# EAGLE schematic Welder_PSU (EAGLE 9.6.2)
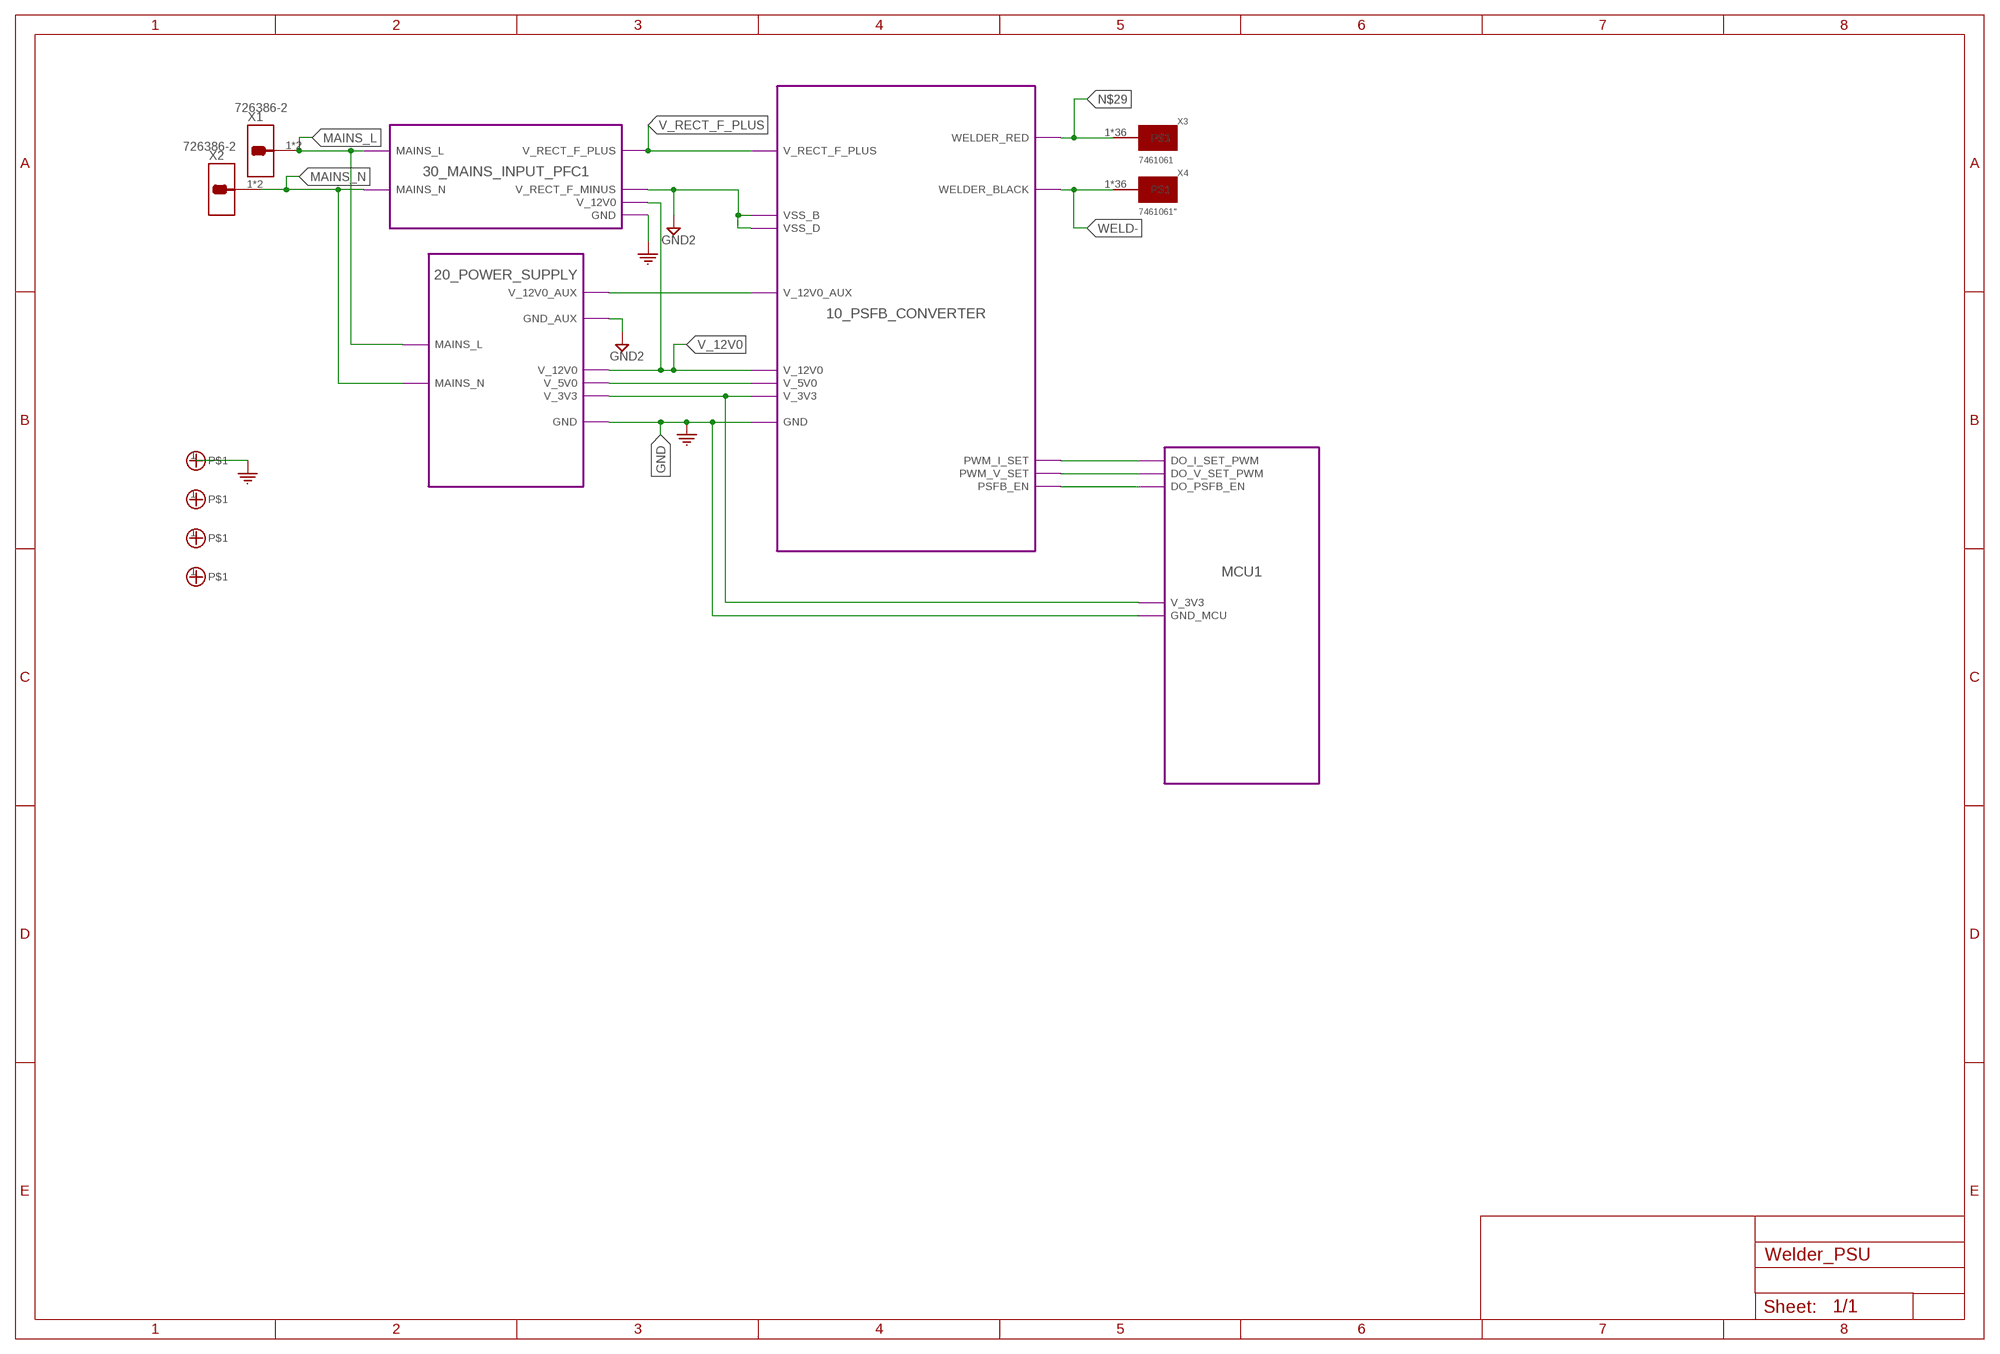
[diagram p0: schematic, sheet 1]

## Parts
M1  M_HOLE_3M  [PCB_SCREW_M3_POWER]
M2  M_HOLE_3M  [PCB_SCREW_M3_POWER]
M3  M_HOLE_3M  [PCB_SCREW_M3_POWER]
M4  M_HOLE_3M  [PCB_SCREW_M3_POWER]
X1  726386-2  [TE_726386-2_MODIFIED]
X2  726386-2  [TE_726386-2_MODIFIED]
X3  7461061  [X01_M10_7461061]
X4  7461061"  [X01_M10_7461061_MODIFIED]

## Module instances
10_PSFB_CONVERTER = 10_PSFB_CONVERTER (part numbers offset by 100)
20_POWER_SUPPLY = 20_POWER_SUPPLY (part numbers offset by 200)
MCU1 = 40_MCU (part numbers offset by 400)
30_MAINS_INPUT_PFC1 = 30_MAINS_INPUT_PFC (part numbers offset by 300)

## Nets
GND [LV]: M1.1 ; port 30_MAINS_INPUT_PFC1.GND 10_PSFB_CONVERTER.GND 20_POWER_SUPPLY.GND MCU1.GND_MCU
GND2 [HV-Minus]: port 30_MAINS_INPUT_PFC1.V_RECT_F_MINUS 10_PSFB_CONVERTER.VSS_B 10_PSFB_CONVERTER.VSS_D 20_POWER_SUPPLY.GND_AUX
MAINS_L [HV-L]: X1.1 X1.1-2 ; port 30_MAINS_INPUT_PFC1.MAINS_L 20_POWER_SUPPLY.MAINS_L
MAINS_N [HV-N]: X2.1 X2.1-2 ; port 30_MAINS_INPUT_PFC1.MAINS_N 20_POWER_SUPPLY.MAINS_N
N$1: port 10_PSFB_CONVERTER.PWM_I_SET MCU1.DO_I_SET_PWM
N$2: port 10_PSFB_CONVERTER.PWM_V_SET MCU1.DO_V_SET_PWM
N$3: port 10_PSFB_CONVERTER.PSFB_EN MCU1.DO_PSFB_EN
N$29 [LV]: X3.1 X3.1-1 X3.1-2 X3.1-3 X3.1-4 X3.1-5 X3.1-6 X3.1-7 X3.1-8 X3.1-9 X3.1-10 X3.1-11 X3.1-12 X3.1-13 X3.1-14 X3.1-15 X3.1-16 X3.1-17 X3.1-18 X3.1-19 X3.1-20 X3.1-21 X3.1-22 X3.1-23 X3.1-24 X3.1-25 X3.1-26 X3.1-27 X3.1-28 X3.1-29 X3.1-30 X3.1-31 X3.1-32 X3.1-33 X3.1-34 X3.1-35 ; port 10_PSFB_CONVERTER.WELDER_RED
V_3V3 [LV]: port 20_POWER_SUPPLY.V_3V3 10_PSFB_CONVERTER.V_3V3 MCU1.V_3V3
V_5V0: port 20_POWER_SUPPLY.V_5V0 10_PSFB_CONVERTER.V_5V0
V_12V0: port 20_POWER_SUPPLY.V_12V0 10_PSFB_CONVERTER.V_12V0 30_MAINS_INPUT_PFC1.V_12V0
V_12V0_AUX [HV-Minus]: port 20_POWER_SUPPLY.V_12V0_AUX 10_PSFB_CONVERTER.V_12V0_AUX
V_RECT_F_PLUS [HV-Plus]: port 30_MAINS_INPUT_PFC1.V_RECT_F_PLUS 10_PSFB_CONVERTER.V_RECT_F_PLUS
WELD-: X4.1 X4.1-1 X4.1-2 X4.1-3 X4.1-4 X4.1-5 X4.1-6 X4.1-7 X4.1-8 X4.1-9 X4.1-10 X4.1-11 X4.1-12 X4.1-13 X4.1-14 X4.1-15 X4.1-16 X4.1-17 X4.1-18 X4.1-19 X4.1-20 X4.1-21 X4.1-22 X4.1-23 X4.1-24 X4.1-25 X4.1-26 X4.1-27 X4.1-28 X4.1-29 X4.1-30 X4.1-31 X4.1-32 X4.1-33 X4.1-34 X4.1-35 ; port 10_PSFB_CONVERTER.WELDER_BLACK
Unconnected: M2.1 M3.1 M4.1

## Library data of the parts
M1-M4 = Labops_Lib_AH:M_HOLE_3M
X1 X2 = Labops_Lib_AH:726386-2: Terminals, Faston, GDS-Flachstecker 6.3x0.8mm, TE; DESCRIPTION: 0.250" (6.35mm) Quick Connect Male - Solder Connector Non-Insulated; MFN: 726386-2; MFR: TE Connectivity; PART_VALUE: 6.35mmx8mm; PRICE-1: 0.24; SUPPLIER-1: Digikey
X3 X4 = 3D_MIG_Controller:7461061: Pin Screw Terminal, Power Tap M10 Through Hole, Pressfit, Redcube series

## Module 10_PSFB_CONVERTER
Ports: V_12V0(in) V_12V0_AUX(in) V_5V0(in) V_3V3(in) WELDER_RED(io) WELDER_BLACK(io) PWM_I_SET(io) V_RECT_F_PLUS(io) VSS_B(io) VSS_D(io) GND(io) PWM_V_SET(io) PSFB_EN(io)
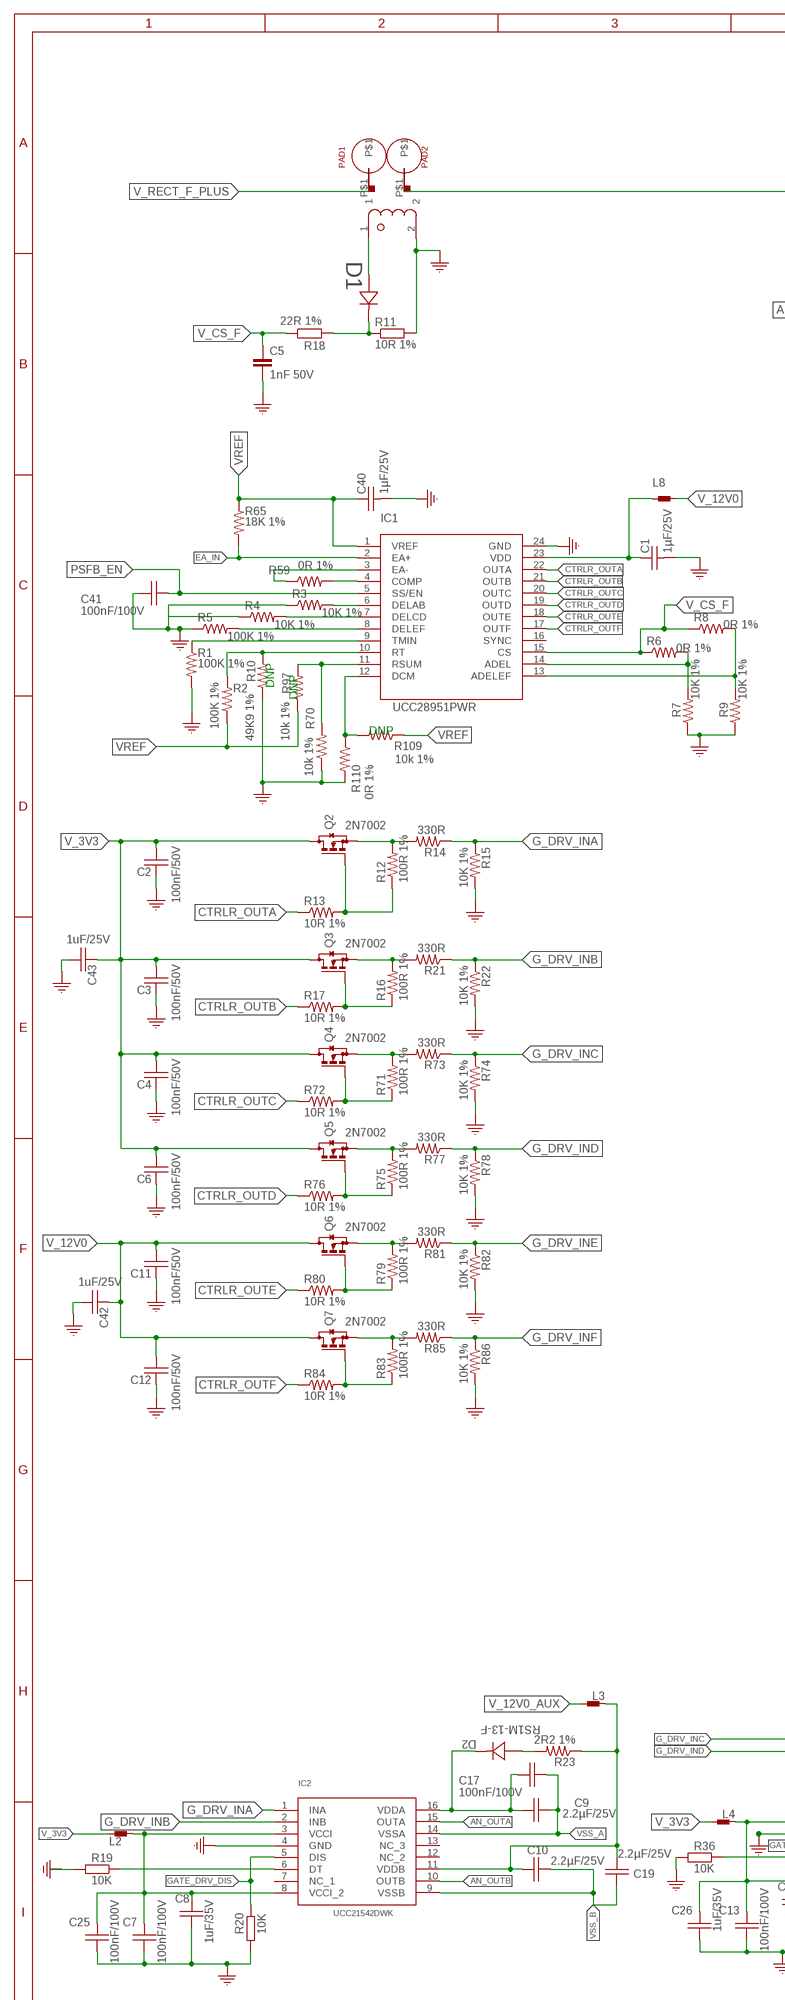
[diagram p1: schematic, module 10_PSFB_CONVERTER, sheet 1, part 1 of 2]
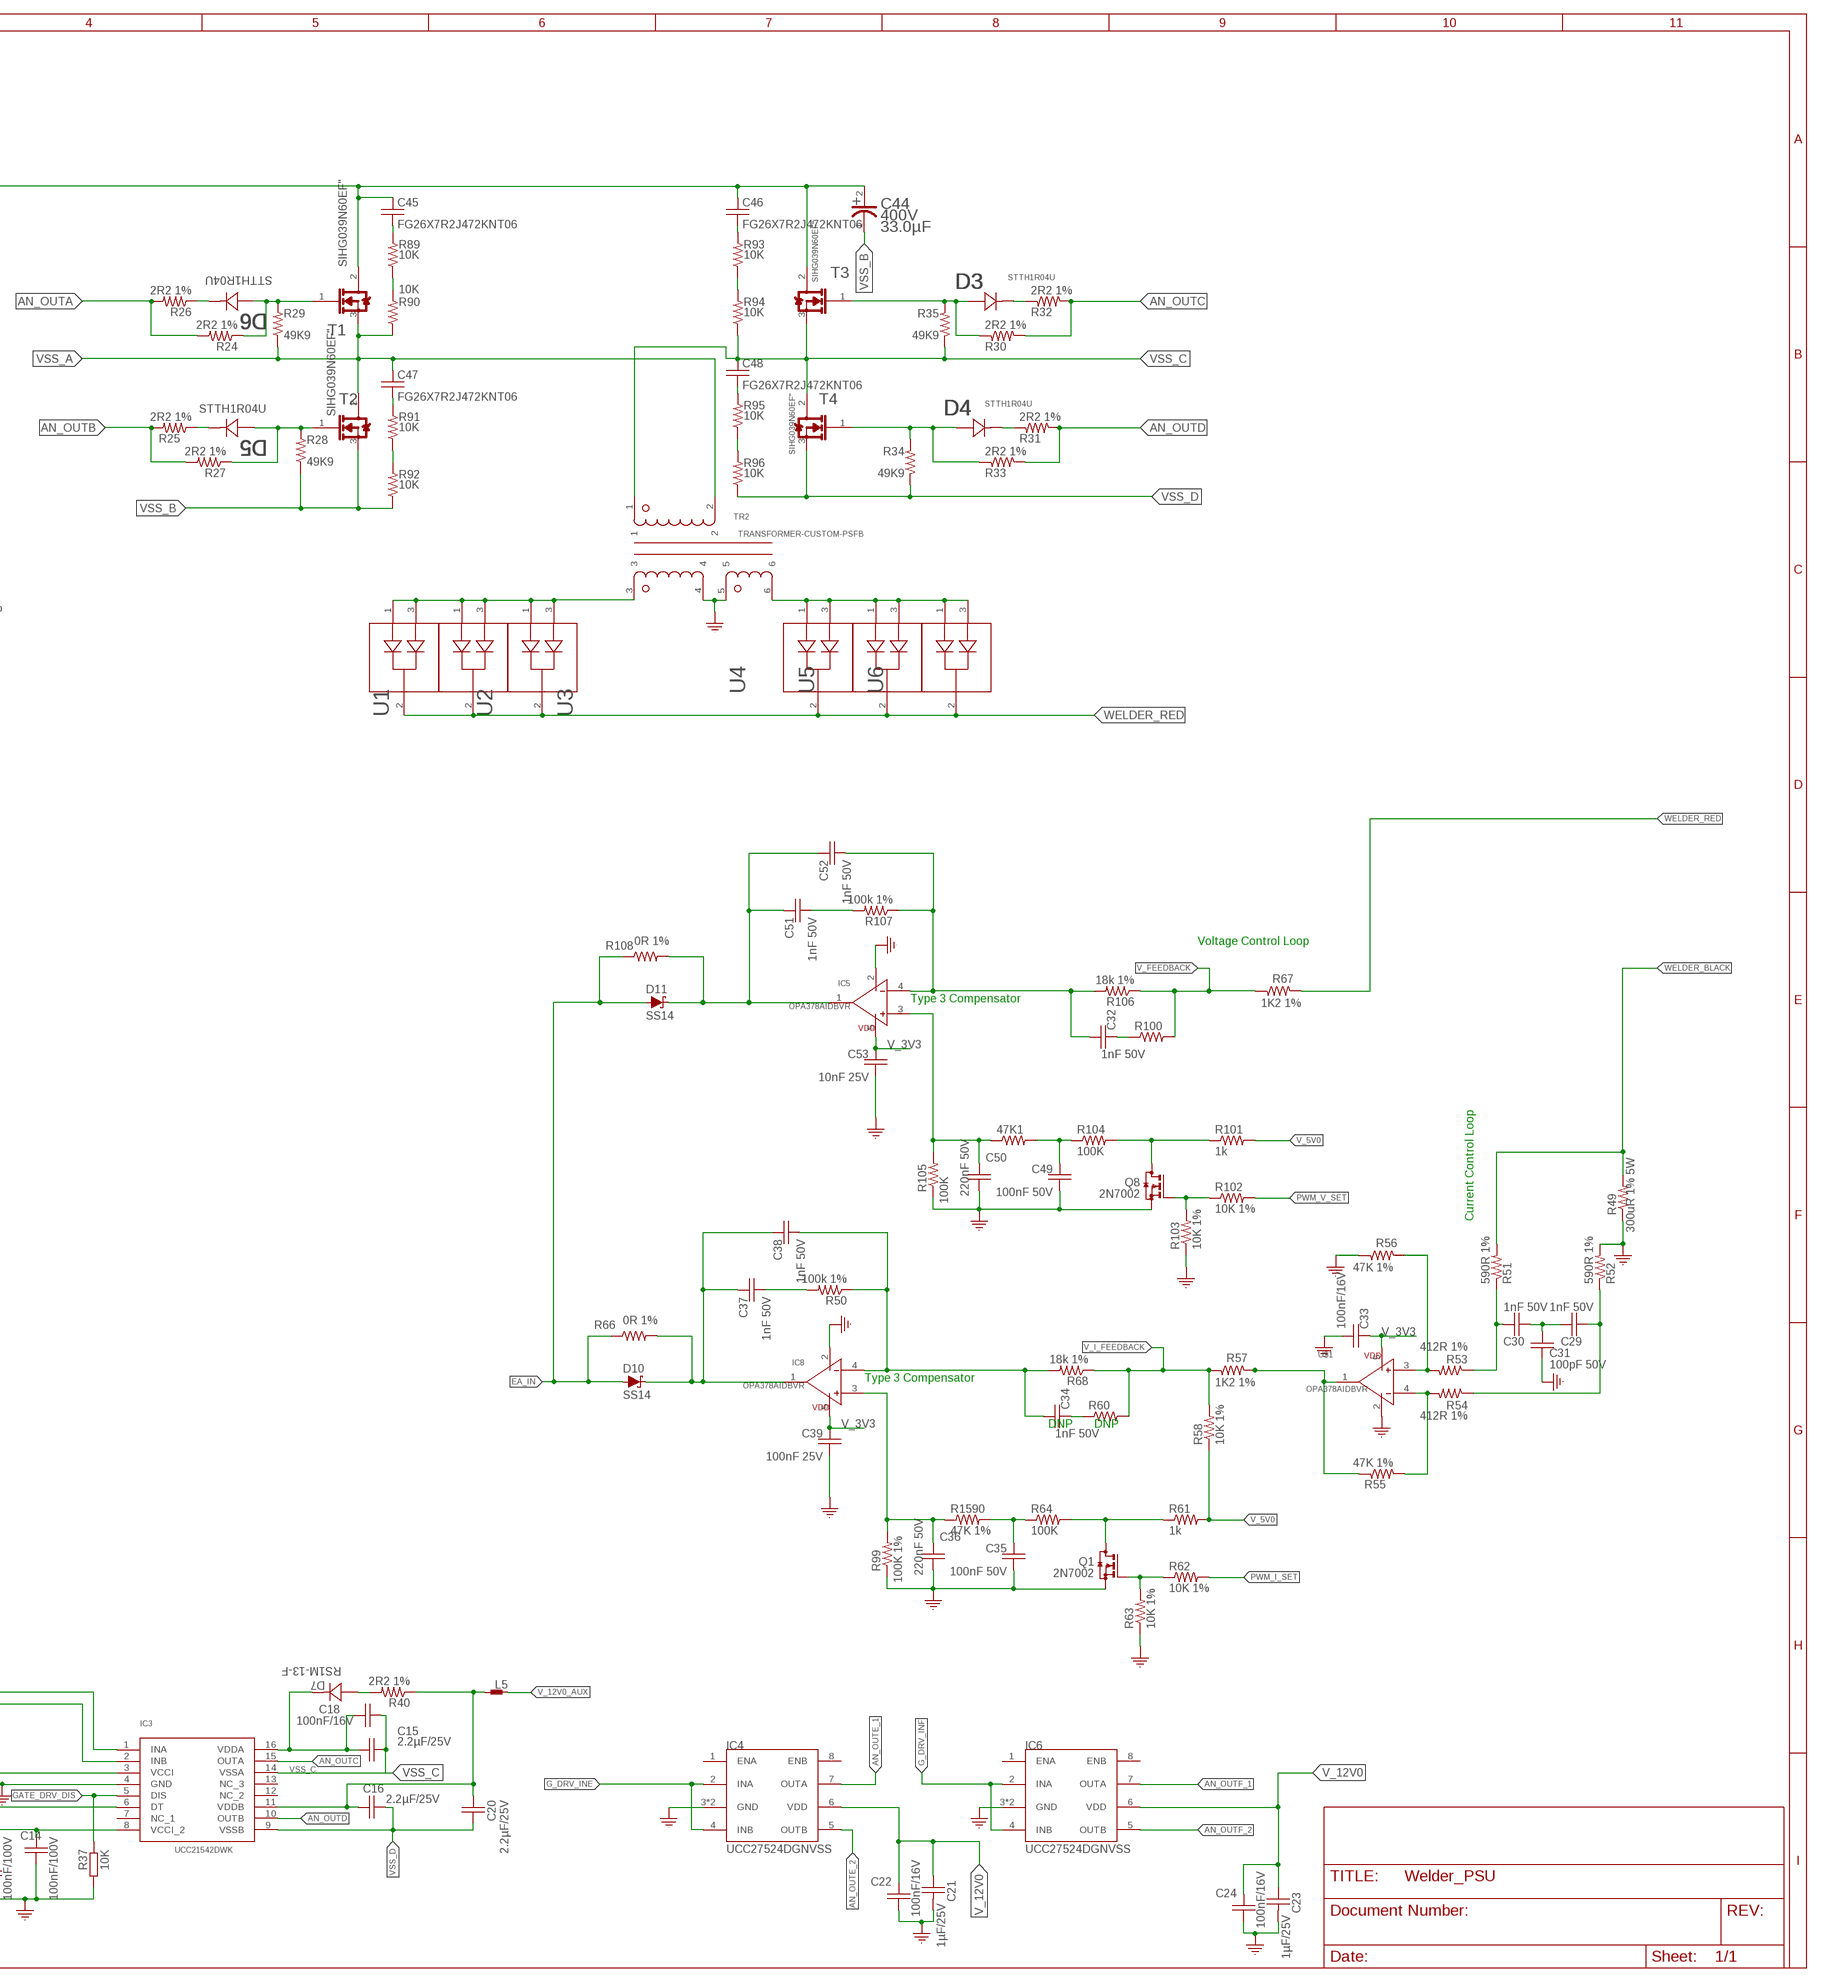
[diagram p2: schematic, module 10_PSFB_CONVERTER, sheet 1, part 2 of 2]

### Parts
47K1  R_0603  [R0603]
C1  1µF/25V  C_0603  [0603]
C2  100nF/50V  C_0603  [0603]
C3  100nF/50V  C_0603  [0603]
C4  100nF/50V  C_0603  [0603]
C5  1nF 50V  C-EUC0603  [C0603]
C6  100nF/50V  C_0603  [0603]
C7  100nF/100V  C_0603  [0603]
C8  1uF/35V  C_0603  [0603]
C9  2.2µF/25V  C_0603  [0603]
C10  2.2µF/25V  C_0603  [0603]
C11  100nF/50V  C_0603  [0603]
C12  100nF/50V  C_0603  [0603]
C13  100nF/100V  C_0603  [0603]
C14  100nF/100V  C_0603  [0603]
C15  2.2µF/25V  C_0603  [0603]
C16  2.2µF/25V  C_0603  [0603]
C17  100nF/100V  C_0603  [0603]
C18  100nF/16V  C_0603  [0603]
C19  2.2µF/25V  C_0603  [0603]
C20  2.2µF/25V  C_0603  [0603]
C21  1µF/25V  C_0603  [0603]
C22  100nF/16V  C_0603  [0603]
C23  1µF/25V  C_0603  [0603]
C24  100nF/16V  C_0603  [0603]
C25  100nF/100V  C_0603  [0603]
C26  1uF/35V  C_0603  [0603]
C29  1nF 50V  C_0603  [0603]
C30  1nF 50V  C_0603  [0603]
C31  100pF 50V  C_0603  [0603]
C32  1nF 50V  C_0603  [0603]
C33  100nF/16V  C_0603  [0603]
C34  1nF 50V  C_0603  [0603]
C35  100nF 50V  C_0603  [0603]
C36  220nF 50V  C_0603  [0603]
C37  1nF 50V  C_0603  [0603]
C38  1nF 50V  C_0603  [0603]
C39  100nF 25V  C_0603  [0603]
C40  1µF/25V  C_0603  [0603]
C41  100nF/100V  C_0603  [0603]
C42  1uF/25V  C_0603  [0603]
C43  1uF/25V  C_0603  [0603]
C44  860011378008  [RADIAL_D13.0P5.0H25.0]
C45  FG26X7R2J472KNT06  [CAP_DISC_P5H13]
C46  FG26X7R2J472KNT06  [CAP_DISC_P5H13]
C47  FG26X7R2J472KNT06  [CAP_DISC_P5H13]
C48  FG26X7R2J472KNT06  [CAP_DISC_P5H13]
C49  100nF 50V  C_0603  [0603]
C50  220nF 50V  C_0603  [0603]
C51  1nF 50V  C_0603  [0603]
C52  1nF 50V  C_0603  [0603]
C53  10nF 25V  C_0603  [0603]
D1  STTH1R04U  [SMB]
D2  RS1M-13-F  [SMA-DIODE]
D3  STTH1R04U  [SMB]
D4  STTH1R04U  [SMB]
D5  STTH1R04U  [SMB]
D6  STTH1R04U  [SMB]
D7  RS1M-13-F  [SMA-DIODE]
D10  SS14  [SMA]
D11  SS14  [SMA]
IC1  UCC28951PWR  [TSSOP24]
IC2  UCC21542DWK  [SOIC16_HV]
IC3  UCC21542DWK  [SOIC16_HV]
IC4  UCC27524DGNVSS  [VSSOP-8]
IC5  OPA378AIDBVR  [SOT-23-5]
IC6  UCC27524DGNVSS  [VSSOP-8]
IC8  OPA378AIDBVR  [SOT-23-5]
L2  BLM18RK601SN1D  [0603]
L3  BLM18RK601SN1D  [0603]
L4  BLM18RK601SN1D  [0603]
L5  BLM18RK601SN1D  [0603]
L8  BLM18RK601SN1D  [0603]
PAD1  THT_PAD_5MM  [THT_PAD_D5.0]
PAD2  THT_PAD_5MM  [THT_PAD_D5.0]
Q1  2N7002  [SOT23]
Q2  2N7002  [SOT23]
Q3  2N7002  [SOT23]
Q4  2N7002  [SOT23]
Q5  2N7002  [SOT23]
Q6  2N7002  [SOT23]
Q7  2N7002  [SOT23]
Q8  2N7002  [SOT23]
R1  100K 1%  R_0603  [R0603]
R2  100K 1%  R_0603  [R0603]
R3  10K 1%  R_0603  [R0603]
R4  10K 1%  R_0603  [R0603]
R5  100K 1%  R_0603  [R0603]
R6  0R 1%  R_0603  [R0603]
R7  10K 1%  R_0603  [R0603]
R8  0R 1%  R_0603  [R0603]
R9  10K 1%  R_0603  [R0603]
R10  49K9 1%  R_0603  [R0603]
R11  10R 1%  R-EU_R1206  [R1206]
R12  100R 1%  R_0603  [R0603]
R13  10R 1%  R_0603  [R0603]
R14  330R  R_0603  [R0603]
R15  10K 1%  R_0603  [R0603]
R16  100R 1%  R_0603  [R0603]
R17  10R 1%  R_0603  [R0603]
R18  22R 1%  R-EU_R0603  [R0603]
R19  10K  R-EU_R0603  [R0603]
R20  10K  R-EU_R0603  [R0603]
R21  330R  R_0603  [R0603]
R22  10K 1%  R_0603  [R0603]
R23  2R2 1%  R_1206  [R1206]
R24  2R2 1%  R_1206  [R1206]
R25  2R2 1%  R_1206  [R1206]
R26  2R2 1%  R_1206  [R1206]
R27  2R2 1%  R_1206  [R1206]
R28  49K9  R_0603  [R0603]
R29  49K9  R_0603  [R0603]
R30  2R2 1%  R_1206  [R1206]
R31  2R2 1%  R_1206  [R1206]
R32  2R2 1%  R_1206  [R1206]
R33  2R2 1%  R_1206  [R1206]
R34  49K9  R_0603  [R0603]
R35  49K9  R_0603  [R0603]
R36  10K  R-EU_R0603  [R0603]
R37  10K  R-EU_R0603  [R0603]
R40  2R2 1%  R_1206  [R1206]
R49  WSL5931L3000FEA  [WSLP3921]
R50  100k 1%  R_0603  [R0603]
R51  590R 1%  R_0603  [R0603]
R52  590R 1%  R_0603  [R0603]
R53  412R 1%  R_0603  [R0603]
R54  412R 1%  R_0603  [R0603]
R55  47K 1%  R_0603  [R0603]
R56  47K 1%  R_0603  [R0603]
R57  1K2 1%  R_0603  [R0603]
R58  10K 1%  R_0603  [R0603]
R59  0R 1%  R_0603  [R0603]
R60  R_0603  [R0603]
R61  1k  R_0603  [R0603]
R62  10K 1%  R_0603  [R0603]
R63  10K 1%  R_0603  [R0603]
R64  100K  R_0603  [R0603]
R65  18K 1%  R_0603  [R0603]
R66  0R 1%  R_0603  [R0603]
R67  1K2 1%  R_0603  [R0603]
R68  18k 1%  R_0603  [R0603]
R70  10k 1%  R_0603  [R0603]
R71  100R 1%  R_0603  [R0603]
R72  10R 1%  R_0603  [R0603]
R73  330R  R_0603  [R0603]
R74  10K 1%  R_0603  [R0603]
R75  100R 1%  R_0603  [R0603]
R76  10R 1%  R_0603  [R0603]
R77  330R  R_0603  [R0603]
R78  10K 1%  R_0603  [R0603]
R79  100R 1%  R_0603  [R0603]
R80  10R 1%  R_0603  [R0603]
R81  330R  R_0603  [R0603]
R82  10K 1%  R_0603  [R0603]
R83  100R 1%  R_0603  [R0603]
R84  10R 1%  R_0603  [R0603]
R85  330R  R_0603  [R0603]
R86  10K 1%  R_0603  [R0603]
R89  10K  R_1206  [R1206]
R90  10K  R_1206  [R1206]
R91  10K  R_1206  [R1206]
R92  10K  R_1206  [R1206]
R93  10K  R_1206  [R1206]
R94  10K  R_1206  [R1206]
R95  10K  R_1206  [R1206]
R96  10K  R_1206  [R1206]
R97  10k 1%  R_0603  [R0603]
R99  100K 1%  R_0603  [R0603]
R100  R_0603  [R0603]
R101  1k  R_0603  [R0603]
R102  10K 1%  R_0603  [R0603]
R103  10K 1%  R_0603  [R0603]
R104  100K  R_0603  [R0603]
R105  100K  R_0603  [R0603]
R106  18k 1%  R_0603  [R0603]
R107  100k 1%  R_0603  [R0603]
R108  0R 1%  R_0603  [R0603]
R109  10k 1%  R_0603  [R0603]
R110  0R 1%  R_0603  [R0603]
R1590  47K 1%  R_0603  [R0603]
T1  SIHG039N60EF"  [TO-247AC_MODIFIED]
T2  SIHG039N60EF"  [TO-247AC_MODIFIED]
T3  SIHG039N60EF"  [TO-247AC_MODIFIED]
T4  SIHG039N60EF"  [TO-247AC_MODIFIED]
TR1  CST206-2A1.5MM-DRILL  [CST206-2A_MODIFIED]
TR2  TRANSFORMER-CUSTOM-PSFB  [TOROID_B64290A0705X830]
U1  FEP30DP-E3/45  [TO-247AD_VIS]
U2  FEP30DP-E3/45  [TO-247AD_VIS]
U3  FEP30DP-E3/45  [TO-247AD_VIS]
U4  FEP30DP-E3/45  [TO-247AD_VIS]
U5  FEP30DP-E3/45  [TO-247AD_VIS]
U6  FEP30DP-E3/45  [TO-247AD_VIS]
U$1  OPA378AIDBVR  [SOT-23-5]

### Nets
AN_OUTA [HV-Plus]: IC2.15(OUTA) R24.2 R26.2
AN_OUTB [HV-Minus]: IC2.10(OUTB) R25.2 R27.2
AN_OUTC [HV-Plus]: IC3.15(OUTA) R30.2 R32.2
AN_OUTD [HV-Minus]: IC3.10(OUTB) R31.2 R33.2
AN_OUTE_1 [LV]: IC4.7(OUTA)
AN_OUTE_2 [LV]: IC4.5(OUTB)
AN_OUTF_1 [LV]: IC6.7(OUTA)
AN_OUTF_2 [LV]: IC6.5(OUTB)
CTRLR_OUTA [LV]: IC1.22(OUTA) R13.1
CTRLR_OUTB [LV]: IC1.21(OUTB) R17.1
CTRLR_OUTC [LV]: IC1.20(OUTC) R72.1
CTRLR_OUTD [LV]: IC1.19(OUTD) R76.1
CTRLR_OUTE [LV]: IC1.18(OUTE) R80.1
CTRLR_OUTF [LV]: IC1.17(OUTF) R84.1
EA_IN [LV]: D10.2(A) D11.2(A) IC1.2(EA+) R65.2 R66.1 R108.1
G_DRV_INA [LV]: IC2.1(INA) R14.1 R15.1
G_DRV_INB [LV]: IC2.2(INB) R21.1 R22.1
G_DRV_INC [LV]: IC3.1(INA) R73.1 R74.1
G_DRV_IND [LV]: IC3.2(INB) R77.1 R78.1
G_DRV_INE [LV]: IC4.2(INA) IC4.4(INB) R81.1 R82.1
G_DRV_INF [LV]: IC6.2(INA) IC6.4(INB) R85.1 R86.1
GATE_DRV_DIS [LV]: IC2.5(DIS) IC3.5(DIS) R20.1 R37.1
GND [LV]: C1.2 C2.1 C3.1 C4.1 C5.2 C6.1 C7.1 C8.1 C11.1 C12.1 C13.1 C14.1 C21.2 C22.1 C23.2 C24.1 C25.1 C26.1 C31.1 C33.2 C35.2 C36.2 C39.2 C40.2 C41.2 C42.2 C43.2 C49.2 C50.2 C53.2 IC1.24(GND) IC2.4(GND) IC3.4(GND) IC4.3(GND) IC4.3-2(GND) IC5.2(VSS) IC6.3(GND) IC6.3-2(GND) IC8.2(VSS) Q1.2(S) Q8.2(S) R1.2 R3.1 R4.1 R5.1 R7.1 R9.1 R10.1 R11.2 R15.2 R19.2 R20.2 R22.2 R36.2 R37.2 R49.1 R52.2 R56.1 R63.1 R70.1 R74.2 R78.2 R82.2 R86.2 R99.1 R103.1 R105.1 R110.2 TR1.2 TR2.4 TR2.5 U$1.2(VSS)
N$1 [LV]: IC1.12(DCM) R109.2 R110.1
N$2 [LV]: IC1.6(DELAB) R3.2
N$3 [LV]: IC1.7(DELCD) R4.2
N$4 [LV]: IC1.8(DELEF) R5.2
N$5 [LV]: IC2.6(DT) R19.1
N$6 [LV]: IC1.14(ADEL) R6.2 R7.2
N$7 [LV]: IC1.9(TMIN) R1.1
N$8 [LV]: IC1.13(ADELEF) R8.2 R9.2
N$9 [LV]: IC1.10(RT) R2.2 R10.2
N$10: D6.1 R26.1
N$11: D1.2 TR1.1
N$12 [LV]: D1.1 R11.1 R18.2
N$13 [LV]: Q2.1(G) R12.1 R13.2
N$14 [LV]: Q2.2(S) R12.2 R14.2
N$15 [HV-Minus]: C16.1 C20.1 IC3.11(VDDB) L5.2 R40.1
N$16 [HV-Minus]: D5.1 R25.1
N$17 [LV]: Q3.1(G) R16.1 R17.2
N$18 [LV]: Q3.2(S) R16.2 R21.2
N$19: C7.2 C8.2 C25.2 IC2.3(VCCI) IC2.8(VCCI_2) L2.2
N$20 [HV-Plus]: C9.1 C17.2 D2.C IC2.16(VDDA)
N$21 [HV-Minus]: D5.2 R27.1 R28.2 T2.1(G)
N$22 [HV-Minus]: D2.A R23.2
N$23 [HV-Minus]: C10.1 C19.1 IC2.11(VDDB) L3.1 R23.1
N$24: D6.2 R24.1 R29.2 T1.1(G)
N$26: TR2.3 U1.1 U1.3 U2.1 U2.3 U3.1 U3.3
N$27 [LV]: IC3.6(DT) R36.1
N$28 [LV]: C13.2 C14.2 C26.2 IC3.3(VCCI) IC3.8(VCCI_2) L4.1
N$29: TR2.6 U4.1 U4.3 U5.1 U5.3 U6.1 U6.3
N$30: D3.1 R32.1
N$31 [HV-Plus]: C15.1 C18.2 D7.C IC3.16(VDDA)
N$32 [LV]: C1.1 IC1.23(VDD) L8.1
N$33 [HV-Minus]: D4.1 R31.1
N$34 [HV-Minus]: D4.2 R33.1 R34.2 T4.1(G)
N$35 [HV-Plus]: C45.2 R89.2
N$36: D7.A R40.2
N$38: D3.2 R30.1 R35.2 T3.1(G)
N$39 [LV]: Q4.1(G) R71.1 R72.2
N$40 [LV]: Q4.2(S) R71.2 R73.2
N$45 [LV]: IC1.11(RSUM) R70.2 R97.2
N$47 [LV]: C29.1 R52.1 R54.1
N$48 [LV]: C29.2 C30.1 C31.2
N$49 [LV]: C30.2 R51.1 R53.1
N$50 [LV]: R53.2 R56.2 U$1.3(NON-INV)
N$51 [LV]: R54.2 R55.2 U$1.4(INV)
N$52 [LV]: R55.1 R57.2 U$1.1(VOUT)
N$53 [HV-Plus]: R89.1 R90.2
N$54 [LV]: C34.1 R60.1
N$55 [LV]: IC1.4(COMP) R59.2
N$56 [LV]: Q1.3(D) R61.1 R64.2
N$57 [LV]: C35.1 R64.1 R1590.2
N$58 [LV]: C36.1 IC8.3(NON-INV) R99.2 R1590.1
N$59 [LV]: C37.2 R50.2
N$61 [LV]: Q1.1(G) R62.1 R63.2
N$62 [LV]: Q5.1(G) R75.1 R76.2
N$63 [LV]: C37.1 C38.1 D10.1(C) IC8.1(VOUT) R66.2
N$64 [LV]: IC1.3(EA-) R59.1
N$65 [LV]: Q5.2(S) R75.2 R77.2
N$66: C47.2 R91.2
N$67 [LV]: Q6.1(G) R79.1 R80.2
N$68 [LV]: Q6.2(S) R79.2 R81.2
N$69: R91.1 R92.2
N$70 [LV]: Q7.1(G) R83.1 R84.2
N$71 [LV]: Q7.2(S) R83.2 R85.2
N$72: R95.1 R96.2
N$73: C48.2 R95.2
N$74 [HV-Plus]: R93.1 R94.2
N$75: C46.2 R93.2
N$76 [LV]: Q8.3(D) R101.1 R104.2
N$77 [LV]: C34.2 C38.2 IC8.4(INV) R50.1 R68.2
N$78 [LV]: 47K1.2 C49.1 R104.1
N$79 [LV]: 47K1.1 C50.1 IC5.3(NON-INV) R105.2
N$80 [LV]: Q8.1(G) R102.1 R103.2
N$81 [LV]: C51.2 R107.2
N$82 [LV]: C51.1 C52.1 D11.1(C) IC5.1(VOUT) R108.2
N$83 [LV]: C32.1 R100.1
N$84 [LV]: C32.2 C52.2 IC5.4(INV) R106.2 R107.1
PSFB_EN [LV]: C41.1 IC1.5(SS/EN)
PWM_I_SET [LV]: R62.2
PWM_V_SET [LV]: R102.2
V_3V3 [LV]: C2.2 C3.2 C4.2 C6.2 C33.1 C39.1 C43.1 C53.1 IC5.5(VDD) IC8.5(VDD) L2.1 L4.2 Q2.3(D) Q3.3(D) Q4.3(D) Q5.3(D) U$1.5(VDD)
V_5V0 [LV]: R58.1 R61.2 R101.2
V_12V0 [LV]: C11.2 C12.2 C21.1 C22.2 C23.1 C24.2 C42.1 IC4.6(VDD) IC6.6(VDD) L8.2 Q6.3(D) Q7.3(D)
V_12V0_AUX [HV-Minus]: L3.2 L5.1
V_CS_F [LV]: C5.1 IC1.15(CS) R6.1 R8.1 R18.1
V_FEEDBACK [LV]: R67.1 R100.2 R106.1
V_I_FEEDBACK [LV]: R57.1 R58.2 R60.2 R68.1
V_RECT_F_PLUS [HV-Plus]: C44.2(ANODE) C45.1 C46.1 PAD1.P$1 PAD2.P$1 T1.2(D) T3.2(D)
VREF [LV]: C40.1 IC1.1(VREF) R2.1 R65.1 R97.1 R109.1
VSS_A [HV-Plus]: C9.2 C17.1 C47.1 IC2.14(VSSA) R29.1 R90.1 T1.3(S) T2.2(D) TR2.2
VSS_B [HV-Minus]: C10.2 C19.2 C44.1(CATHODE) IC2.9(VSSB) R28.1 R92.1 T2.3(S)
VSS_C [HV-Plus]: C15.2 C18.1 C48.1 IC3.14(VSSA) R35.1 R94.1 T3.3(S) T4.2(D) TR2.1
VSS_D [HV-Minus]: C16.2 C20.2 IC3.9(VSSB) R34.1 R96.1 T4.3(S)
WELDER_BLACK [LV]: R49.2 R51.2
WELDER_RED [LV]: R67.2 U1.2 U2.2 U3.2 U4.2 U5.2 U6.2
Unconnected: IC1.16(SYNC) IC2.7(NC_1) IC2.12(NC_2) IC2.13(NC_3) IC3.7(NC_1) IC3.12(NC_2) IC3.13(NC_3) IC4.1(ENA) IC4.8(ENB) IC6.1(ENA) IC6.8(ENB)

### Notes on the sheet
- DNP
- DNP
- DNP
- Voltage Control Loop
- Type 3 Compensator
- Current Control Loop
- Type 3 Compensator
- DNP | DNP

### Library data of the parts
47K1 R1-R10 R12-R17 R21 R22 R28 R29 R34 R35 R50-R68 R70-R86 R97 R99-R110 R1590 = Labops_Lib_AH:R_0603; MFN: Open Source
C1 C21 C23 C40 = 3D_MIG_Controller:C_0603
C2-C4 C6 C8-C16 C19 C20 C22 C24 C26 C29-C39 C42 C43 C49-C53 = Labops_Lib_AH:C_0603; MFN: Open Source
C5 = rcl:C-EU: CAPACITOR, European symbol; SPICEPREFIX: C
C7 C17 C18 C25 C41 = Labops_Lib_AH:C_0603; DESCRIPTION: X7R 10%, 100V, MLCC; MFN: Open Source; PART_VALUE: 100nF/100V
C44 = Labops_Lib_AH:860011378008: Aluminium Electrolytic Capacitor, WCAP-ATG8 Series, 33 F, 20%, 400 V, 13 mm, Radial Leaded; DESCRIPTION: Electrolytic Cap 33µF 400V 13mm Radial WCAP-ATG8; Lifetime 2000h +85°C; LIB_STATUS: Verified; MFN: 860011378008; MFR: Wurth Elektronik; OUR_STOCK: 4; PART_VALUE: 33uF/400V; SUPPLIER-1: Digikey
C45-C48 = Labops_Lib_AH:FG26X7R2J472KNT06; DESCRIPTION: 4700 pF ±10% 630V Ceramic Capacitor X7R Radial; LIB_STATUS: Prototype; MFN: FG26X7R2J472KNT06; MFR: TDK; OUR_STOCK: 30; PART_VALUE: 4.7nF/630V; PRICE-1: 0.17; SUPPLIER-1: LCSC
D1 D3-D6 = Labops_Lib_AH:STTH1R04U; DESCRIPTION: DIODE GEN PURP 400V 1A SMB; LIB_STATUS: Prototype; MFN: STTH1R04U; MFR: ST; OUR_STOCK: 30; PART_VALUE: STTH1R04U; PRICE-1: 0.01; SUPPLIER-1: LCSC
D2 D7 = Labops_Lib_AH:RS1M-13-F; DESCRIPTION: Gen Purpose , 1KV,1A, 500ns, SMA; LIB_STATUS: Prototype; MFN: RS1M-13-F; MFR: Diodes; OUR_STOCK: 10; PART_VALUE: RS1M-13-F; PRICE-1: 0.07; SUPPLIER-1: LCSC
D10 D11 = Labops_Lib_AH:SS14; DESCRIPTION: Diode Schottky 1A/40V (SMA); LIB_STATUS: Prototype; MFN: SS14-LTP; MFR: MCC; OUR_STOCK: 10; PART_VALUE: Schottky 1A/40V; PRICE-1: 0.05; SUPPLIER-1: LCSC
IC1 = 3D_MIG_Controller:UCC28951PWR: Phase Shift Full Bridge SMPS Controller, TI, TSSOP-24
IC2 IC3 = 3D_MIG_Controller:UCC21542DWK: Gate Driver, Dual Channel, with Reinforced Isolation, SOIC-16 High Volt Package
IC4 IC6 = Labops_Lib_AH:UCC27524DGN: Gate Driver, Dual Channel, Noninverting, VSSOP-8 exposed pad, Texas Instruments; DESCRIPTION: Low-Side Gate Driver IC 5A, 4.5-18VNon-Inverting 8-HVSSOP; LIB_STATUS: Prottype; MFN: UCC27524DGN; MFR: Texas Instruments; OUR_STOCK: 12; PART_VALUE: UCC27524DGN; PRICE-1: 1.43; SUPPLIER-1: Digikey
IC5 IC8 U$1 = Labops_Lib_AH:OPA378AIDBVR; DESCRIPTION: IC OPAMP ZER-DRIFT 1CIRC SOT23-5; LIB_STATUS: Prototype; MFN: OPA378AIDBVR; MFR: Texas Instruments; OUR_STOCK: 10; PART_VALUE: Precision OPAMP; SUPPLIER-1: Digikey
L2-L5 L8 = Labops_Lib_AH:BLM18RK601SN1D; DESCRIPTION: 600 Ohms @ 100 MHz 1 - Ferrite Bead 0603; LIB_STATUS: Prototype; MFN: BLM18RK601SN1D; MFR: Murata; OUR_STOCK: 100; PART_VALUE: 600R@100MHz; PRICE-1: 0.05; SUPPLIER-1: Digikey
PAD1 PAD2 = 3D_MIG_Controller:THT_PAD_5MM
Q1-Q8 = Labops_Lib_AH:2N7002; DESCRIPTION: NMOSFET, 500mA, 60V, Vth 2.5V; LIB_STATUS: Prototype; MFN: 2N7002; MFR: Diodes, Guangdong Hotetech,NXP; OUR_STOCK: 100; PART_VALUE: NMOSFET; PRICE-1: 0.02; SUPPLIER-1: LCSC
R11 R18-R20 R36 R37 = rcl:R-EU_: RESISTOR, European symbol; SPICEPREFIX: R
R23-R27 R30-R33 R40 R89-R96 = Labops_Lib_AH:R_1206; LIB_STATUS: Verified; MFN: R_Open_1206
R49 = Labops_Lib_AH:WSL5931L3000FEA; DESCRIPTION: 300 µOhms ±1% 5W Chip Resistor Nonstandard Anti-Sulfur, Automotive AEC-Q200, Current Sense, Moisture Resistant, Pulse Withstanding Metal Element; LIB_STATUS: Verified; MFN: WSL5931L3000FEA; MFR: Vishay; OUR_STOCK: 5; PART_VALUE: 300uR 1% 5W; PRICE-1: 2.1; SUPPLIER-1: Digikey
T1-T4 = 3D_MIG_Controller:SIHG039N60EF: N-Channel, 600V, 61A, TO247AC
TR1 = 3D_MIG_Controller:CST206-2A: Current sense transformer, Iprim_max=80A RMS. 20-200KHz, Triag Magnetics
TR2 = 3D_MIG_Controller:TRANSFORMER-CUSTOM-PSFB: transformer custom made, NP:NS1:NS2 = 1:4.52:4.52, Core= Toroid B64290A0705X830 from Epcos
U1-U6 = Labops_Lib_AH:FEP30DP-E3/45; BUILT_BY: EMA_UL_Team; MANUFACTURER_PART_NUMBER: FEP30DP-E3/45; SOURCELIBRARY: Vishay_2020-02-10; VENDOR: Vishay

## Module 20_POWER_SUPPLY
Ports: MAINS_L(io) MAINS_N(io) V_12V0_AUX(out) V_12V0(out) V_5V0(out) V_3V3(out) GND_AUX(pwr) GND(io)
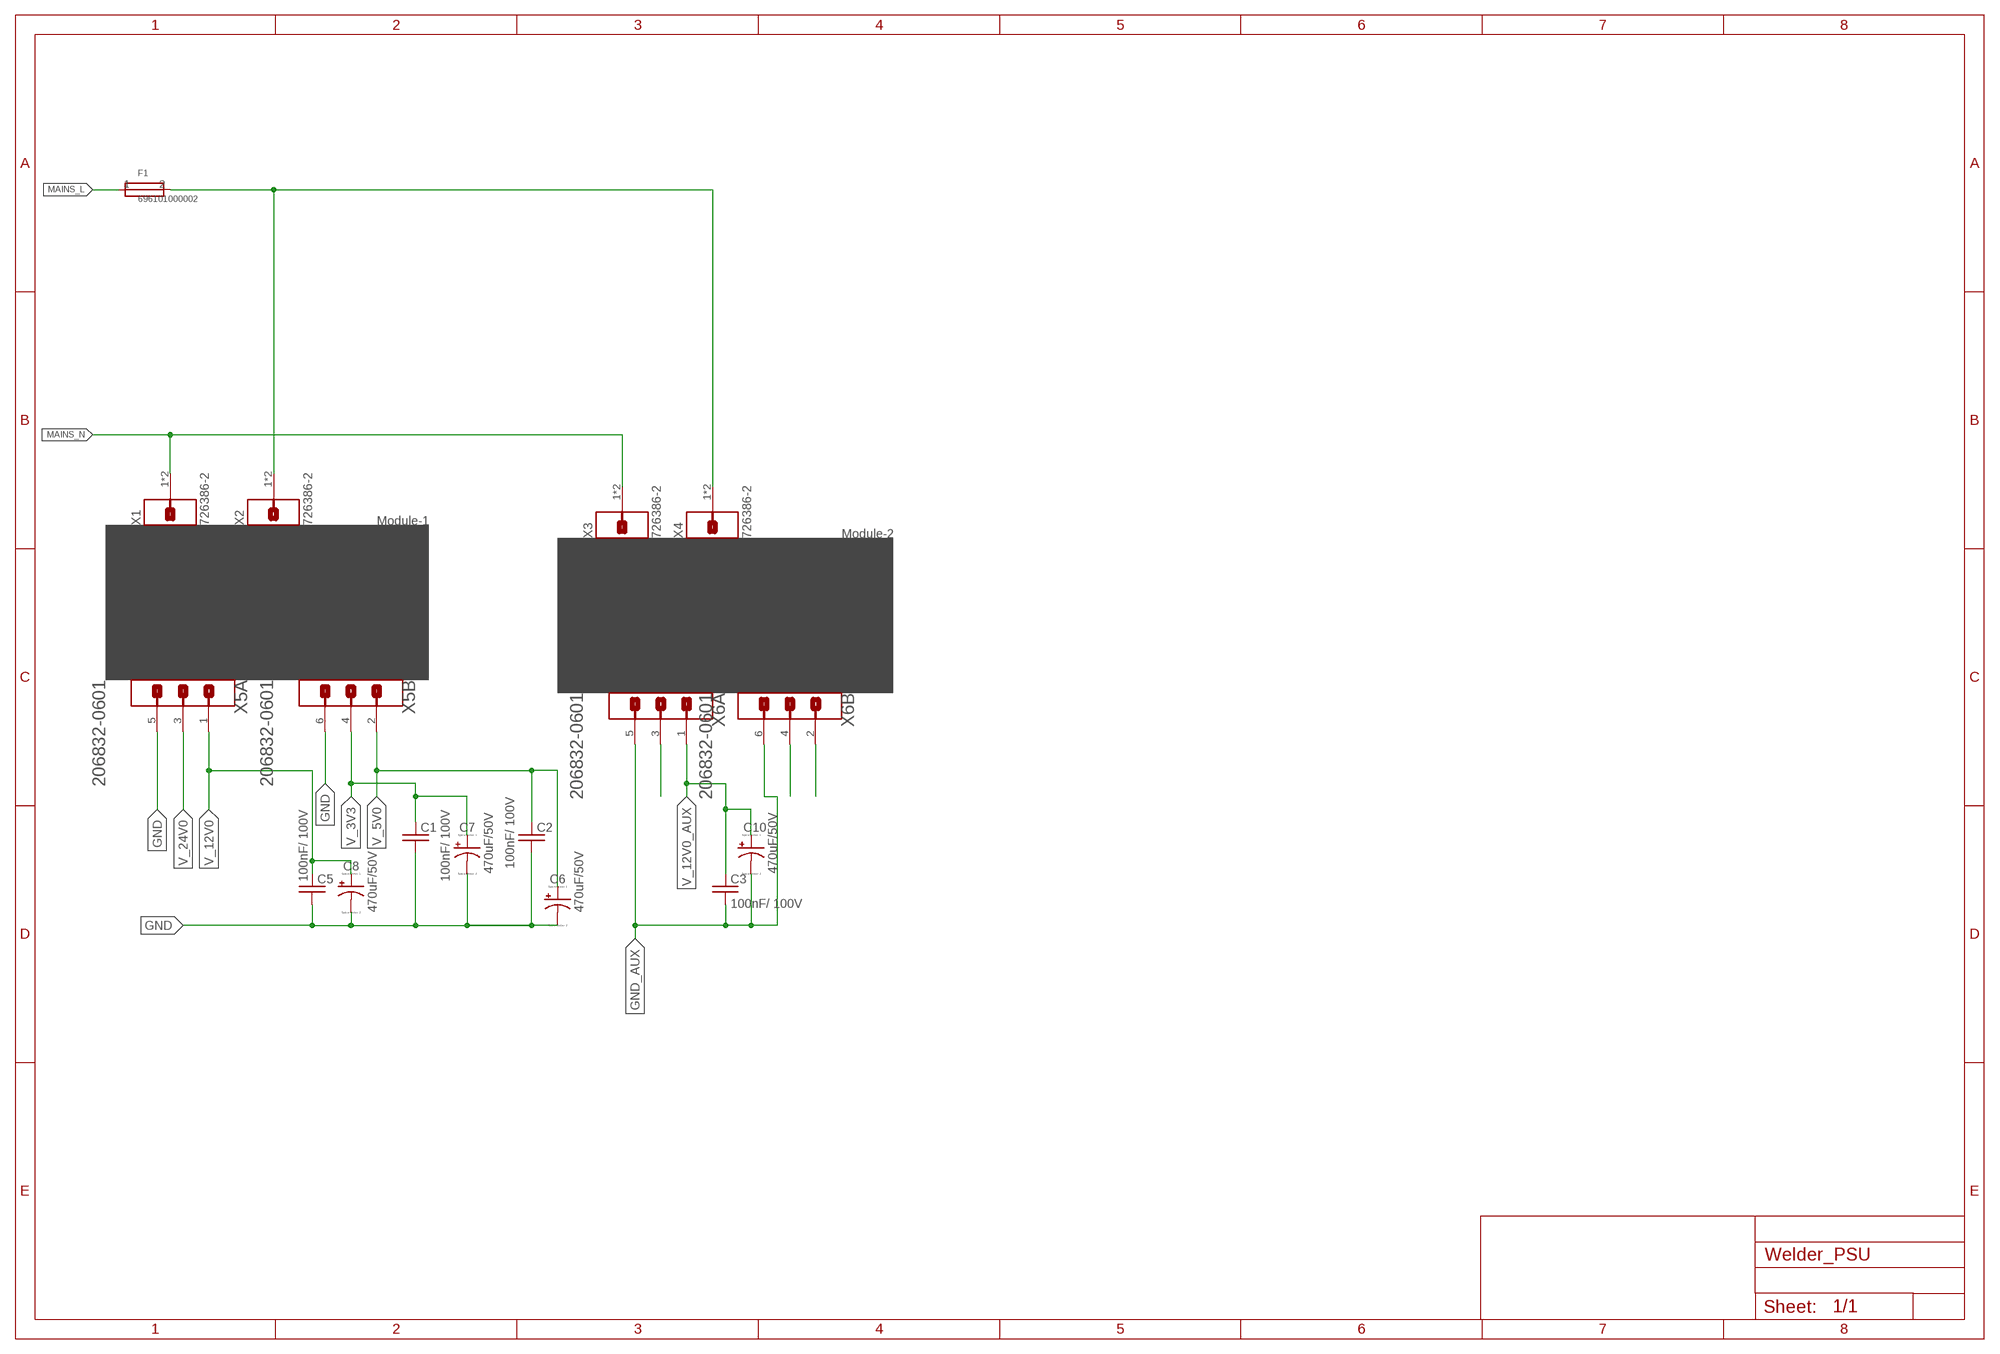
[diagram p3: schematic, module 20_POWER_SUPPLY, sheet 1]

### Parts
C1  100nF/ 100V  C_0603  [0603]
C2  100nF/ 100V  C_0603  [0603]
C3  100nF/ 100V  C_0603  [0603]
C5  100nF/ 100V  C_0603  [0603]
C6  50PX470MEFC10X20  [CAPACITOR-ELKO-RM5-10X16]
C7  50PX470MEFC10X20  [CAPACITOR-ELKO-RM5-10X16]
C8  50PX470MEFC10X20  [CAPACITOR-ELKO-RM5-10X16]
C10  50PX470MEFC10X20  [CAPACITOR-ELKO-RM5-10X16]
F1  696101000002  [FUSE_RM22.6]
X1  726386-2  [TE_726386-2_MODIFIED]
X2  726386-2  [TE_726386-2_MODIFIED]
X3  726386-2  [TE_726386-2_MODIFIED]
X4  726386-2  [TE_726386-2_MODIFIED]
X5  MOLEX_206832-0601MOLEX_206832-0601  [MOLEX_206832-0601]
X6  MOLEX_206832-0601MOLEX_206832-0601  [MOLEX_206832-0601]

### Nets
GND [LV]: C1.2 C2.2 C5.2 C6.2(-) C7.2(-) C8.2(-) X5.5 X5.6
GND_AUX [HV-Minus]: C3.2 C10.2(-) X6.5 X6.6
MAINS_L [HV-L]: F1.1
MAINS_N [HV-N]: X1.1 X1.1-2 X3.1 X3.1-2
N$1 [HV-L]: F1.2 X2.1 X2.1-2 X4.1 X4.1-2
N$2: X6.3
N$5: X6.4
N$6: X6.2
V_3V3 [LV]: C1.1 C7.1(+) X5.4
V_5V0 [LV]: C2.1 C6.1(+) X5.2
V_12V0 [LV]: C5.1 C8.1(+) X5.1
V_12V0_AUX [HV-Minus]: C3.1 C10.1(+) X6.1
V_24V0 [LV]: X5.3

### Notes on the sheet
- Module-1
- Module-2
- Module-1
- Extern Power Supply Module | Extern Power Supply Module

### Library data of the parts
C1-C3 C5 = Labops_Lib_AH:C_0603; MFN: Open Source
C6-C8 C10 = Labops_Lib_AH:50PX470MEFC10X20: Electrolytic Cap, 470µF, 25V, Low ESR, Kemet, Pitch=5mm, Dia=10mm, L=12,5mm; DESCRIPTION: 470uF ±20% 50V 10mm 20mm 5mm 2000Hrs @ 105℃ -55℃ ~ +105℃; LIB_STATUS: Prototype; MFN: 50PX470MEFC10X20; MFR: Rubicon; OUR_STOCK: 20; PART_VALUE: 470uF/50V; PRICE-1: 0.14; SUPPLIER-1: LCSC; TECHNOLOGY: THT
F1 = Labops_Lib_AH:696101000002; DESCRIPTION: Fuse Block 10 A 250V 1 Circuit Cartridge Through Hole; LIB_STATUS: Prototype; MFN: 696101000002; MFR: Wurth Elektronik; OUR_STOCK: 10; PART_VALUE: 10A 5mmx20mm; PRICE-1: 0.64; SUPPLIER-1: Digikey
X1-X4 = Labops_Lib_AH:726386-2: Terminals, Faston, GDS-Flachstecker 6.3x0.8mm, TE; DESCRIPTION: 0.250" (6.35mm) Quick Connect Male - Solder Connector Non-Insulated; MFN: 726386-2; MFR: TE Connectivity; PART_VALUE: 6.35mmx8mm; PRICE-1: 0.24; SUPPLIER-1: Digikey
X5 X6 = Labops_Lib_AH:MOLEX_206832-0601: Connector Header Through Hole 6 position 0.118" (3.00mm); DESCRIPTION: Connector Header Through Hole 6 position 3mm Microfit; LIB_STATUS: Prototype; MFN: 206832-0601; MFR: Molex; OUR_STOCK: 20; PART_VALUE: 6CCT x 2Row; PRICE-1: 1.32; SUPPLIER-1: Digikey

## Module 30_MAINS_INPUT_PFC
Ports: MAINS_L(io) MAINS_N(io) V_RECT_F_PLUS(io) V_RECT_F_MINUS(io) V_12V0(in) GND(pwr)
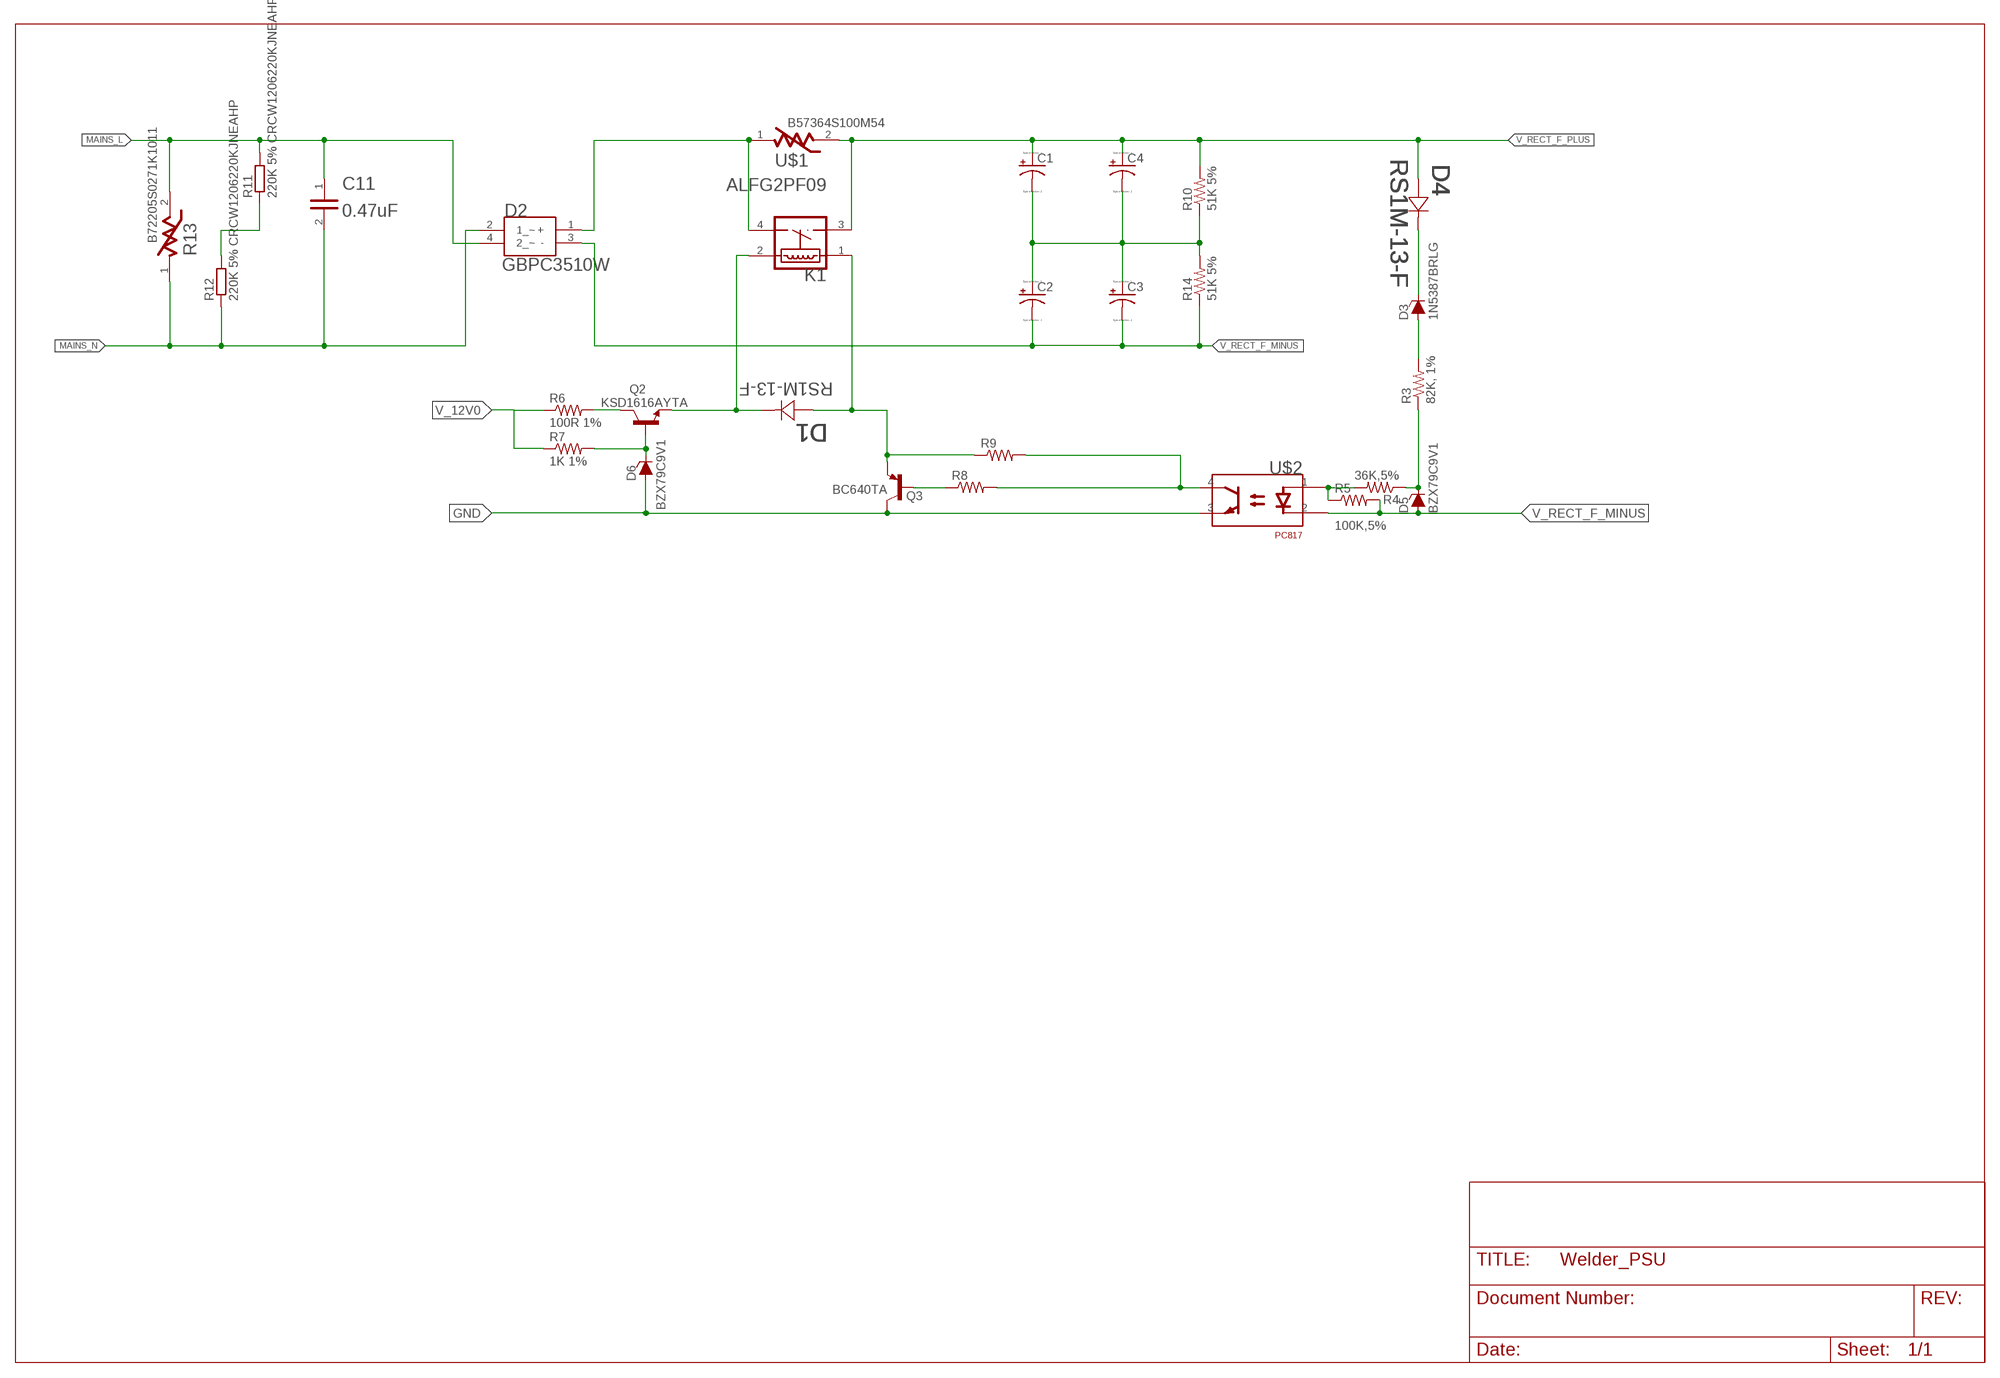
[diagram p4: schematic, module 30_MAINS_INPUT_PFC, sheet 1]

### Parts
C1  C_1500UFCAP_SLP152M250H9P3_MODIFIED  [CAP_SLP152M250H9P3_MODIFIED]
C2  C_1500UFCAP_SLP152M250H9P3_MODIFIED  [CAP_SLP152M250H9P3_MODIFIED]
C3  C_1500UFCAP_SLP152M250H9P3_MODIFIED  [CAP_SLP152M250H9P3_MODIFIED]
C4  C_1500UFCAP_SLP152M250H9P3_MODIFIED  [CAP_SLP152M250H9P3_MODIFIED]
C11  R49AN347050B1MKEMET_R49AN347050B1M_0_0  [KEMET_R49AN347050B1M_0]
D1  RS1M-13-F  [SMA-DIODE]
D2  GBPC3510W1.5MM_DRILL  [GBPC3510W_MODIFIED]
D3  1N5387BRLG  [DO-201AD]
D4  RS1M-13-F  [SMA-DIODE]
D5  BZX79C9V1  [DO-201AD]
D6  BZX79C9V1  [DO-201AD]
K1  PANASONIC_ALFG2PF09_MODIFIED  [PANASONIC_ALFG2PF09_0_MODIFIED]
Q2  KSD1616AYTA  [TO-92]
Q3  BC640TA  [TO-92]
R3  82K, 1%  R_1206  [R1206]
R4  36K,5%  R_0603  [R0603]
R5  100K,5%  R_0603  [R0603]
R6  100R 1%  R_1206  [R1206]
R7  1K 1%  R_1206  [R1206]
R8  R_0603  [R0603]
R9  R_0603  [R0603]
R10  51K 5%  RES_THT_RM20  [RES-RM20-RSF3W]
R11  220K 5% CRCW1206220KJNEAHP  R-EU_R1206  [R1206]
R12  220K 5% CRCW1206220KJNEAHP  R-EU_R1206  [R1206]
R13  B72205S0271K1011  [EPCOS_B72205S0271K101_MODIFIED]
R14  51K 5%  RES_THT_RM20  [RES-RM20-RSF3W]
U$1  B57364S100M54  [VARISTOR_D25_P7.5]
U$2  PC817  [DIP04]

### Nets
GND: D6.A Q3.2(C) U$2.3(EMITTER)
GND_LV [LV]: D1.A K1.1 Q3.1(E) R9.1
MAINS_L [HV-L]: C11.1 D2.4(2_~) R11.2 R13.2
MAINS_N [HV-N]: C11.2 D2.2(1_~) R12.1 R13.1
N$1 [HV-Plus]: C1.2(-) C2.1(+) C3.1(+) C4.2(-) R10.1 R14.2
N$2 [HV-Plus]: D2.1(+) K1.4(COM) U$1.1
N$3: D1.C K1.2 Q2.1(E)
N$5: Q2.2(C) R6.2
N$6: D3.K(C) D4.C
N$7: D3.A R3.2
N$8: R4.2 R5.1 U$2.1(ANODE)
N$9: D5.K(C) R3.1 R4.1
N$12: D6.K(C) Q2.3(B) R7.2
N$13 [HV-L]: R11.1 R12.2
N$16: Q3.3(B) R8.1
N$17: R8.2 R9.2 U$2.4(COLLECTOR)
V_12V0: R6.1 R7.1
V_RECT_F_MINUS [HV-Minus]: C2.2(-) C3.2(-) D2.3(-) D5.A R5.2 R14.1 U$2.2(CATHODE)
V_RECT_F_PLUS [HV-Plus]: C1.1(+) C4.1(+) D4.A K1.3(NO) R10.2 U$1.2

### Library data of the parts
C1-C4 = 3D_MIG_Controller:C_1500UF
C11 = 3D_MIG_Controller:R49AN347050B1M: 0.47µF X Cap 330V 800V Polypropylene (PP), Metallized Radial; AUTOMOTIVE: No; CAPACITANCE: 0.47uF; CENTROID_NOT_SPECIFIED: No; DATASHEET: https://content.kemet.com/datasheets/KEM_F3099_R49_X1_330.pdf; DEVICE_CLASS_L1: Passive Components; DEVICE_CLASS_L2: Capacitors; DEVICE_CLASS_L3: Film Capacitors; DIGIKEY_DESCRIPTION: R49, FILM, METALLIZED POLYPROPYL; DIGIKEY_PART_NUMBER: 399-R49AN347050B1M-ND; FOOTPRINT_VARIANT_NAME_0: Recommended_Land_Pattern; HEIGHT: 18.61mm; LEAD_FREE: Yes; MATERIAL: Polypropylene; MF: Kemet; MFG_PACKAGE_IDENT: 0; MFG_PACKAGE_IDENT_DATE: 0; MFG_PACKAGE_IDENT_REV: 0; MOUSER_PART_NUMBER: 80-R49AN347050B1M; MPN: R49AN347050B1M; PACKAGE: RADIAL; PREFIX: C; ROHS: Yes; TEMPERATURE_RANGE_HIGH: +110°C; TEMPERATURE_RANGE_LOW: -40°C; TOLERANCE: 20%; VAC_X_RATING: X1; VERIFICATION_VERSION: 0.0.0.3; VOLTAGE_AC_RATING_X: 330V; VOLTAGE_RATING: 800V
D1 D4 = Labops_Lib_AH:RS1M-13-F; DESCRIPTION: Gen Purpose , 1KV,1A, 500ns, SMA; LIB_STATUS: Prototype; MFN: RS1M-13-F; MFR: Diodes; OUR_STOCK: 10; PART_VALUE: RS1M-13-F; PRICE-1: 0.07; SUPPLIER-1: LCSC
D2 = 3D_MIG_Controller:GBPC3510W: BRIDGE RECT 1xPhase 1KV 35A GBPC-W Package; MFN: GBPC3510W; MFR-1: On Semi; MFR-2: Taiwan Semi
D3 = Labops_Lib_AH:1N5387BRLG; DESCRIPTION: ±5% 190V 500nA @ 144V 5W Axial Zener Diodes; LIB_STATUS: Prototype; MFN: 1N5387BRLG; MFR: On Semi; OUR_STOCK: 20; PART_VALUE: 190V 5W; PRICE-1: 0.38; SUPPLIER-1: LCSC
D5 D6 = Labops_Lib_AH:BZX79C9V1; DESCRIPTION: Zener Diode 9.1 V 500 mW ±5% Through Hole DO-35; LIB_STATUS: Prototype; MFN: BZX79C9V1; MFR: NXP; OUR_STOCK: 20; PART_VALUE: 9.1V, 500mW; PRICE-1: 0.09; SUPPLIER-1: LCSC
K1 = 3D_MIG_Controller:PANASONIC_ALFG2PF09_MODIFIED: Relay 31A, 9V, SPST-NO (1 Form A) Panasonic
Q2 = Labops_Lib_AH:KSD1616AYTA; DESCRIPTION: NPN 60 V 1 A 160MHz 750 mW Through Hole TO-92-3; LIB_STATUS: Prototype; MFN: KSD1616AYTA; MFR: On Semi; OUR_STOCK: 0; PART_VALUE: NPN; PRICE-1: 0.35; SUPPLIER-1: Digikey
Q3 = Labops_Lib_AH:BC640TA; DESCRIPTION: Bipolar (BJT) Transistor PNP 80 V 1 A 100MHz 1 W Through Hole TO-92-3; LIB_STATUS: Prototype; MFN: BC640TA; MFR: On Semi,; OUR_STOCK: 20; PART_VALUE: BC640TA; PRICE-1: 0.32; SUPPLIER-1: Digikey
R3 R6 R7 = Labops_Lib_AH:R_1206; LIB_STATUS: Verified; MFN: R_Open_1206
R4 R5 R8 R9 = Labops_Lib_AH:R_0603; MFN: Open Source
R10 = Labops_Lib_AH:RES_THT_RM20; MFN: ERG-2SJ513; MFR: Panasonic; PART_VALUE: 51K 5%
R11 R12 = rcl:R-EU_: RESISTOR, European symbol; SPICEPREFIX: R
R13 = 3D_MIG_Controller:B72205S0271K101: VARISTOR 205V 800A DISC 5MM
R14 = Labops_Lib_AH:RES_THT_RM20
U$1 = 3D_MIG_Controller:B57364S100M54: NTC Inrush Current Limiter
U$2 = Labops_Lib_AH:PC817; DESCRIPTION: Optocoupler, 1CH, DIP04, 5KV; LIB_STATUS: Prototype; MFN: PC817; MFR: Sharp, UTC; OUR_STOCK: 20; PART_VALUE: PC817; PRICE-1: 0.05; SUPPLIER-1: LCSC

## Module 40_MCU
Ports: DO_I_SET_PWM(io) GND_MCU(io) DO_PSFB_EN(io) DO_V_SET_PWM(io) V_3V3(io)
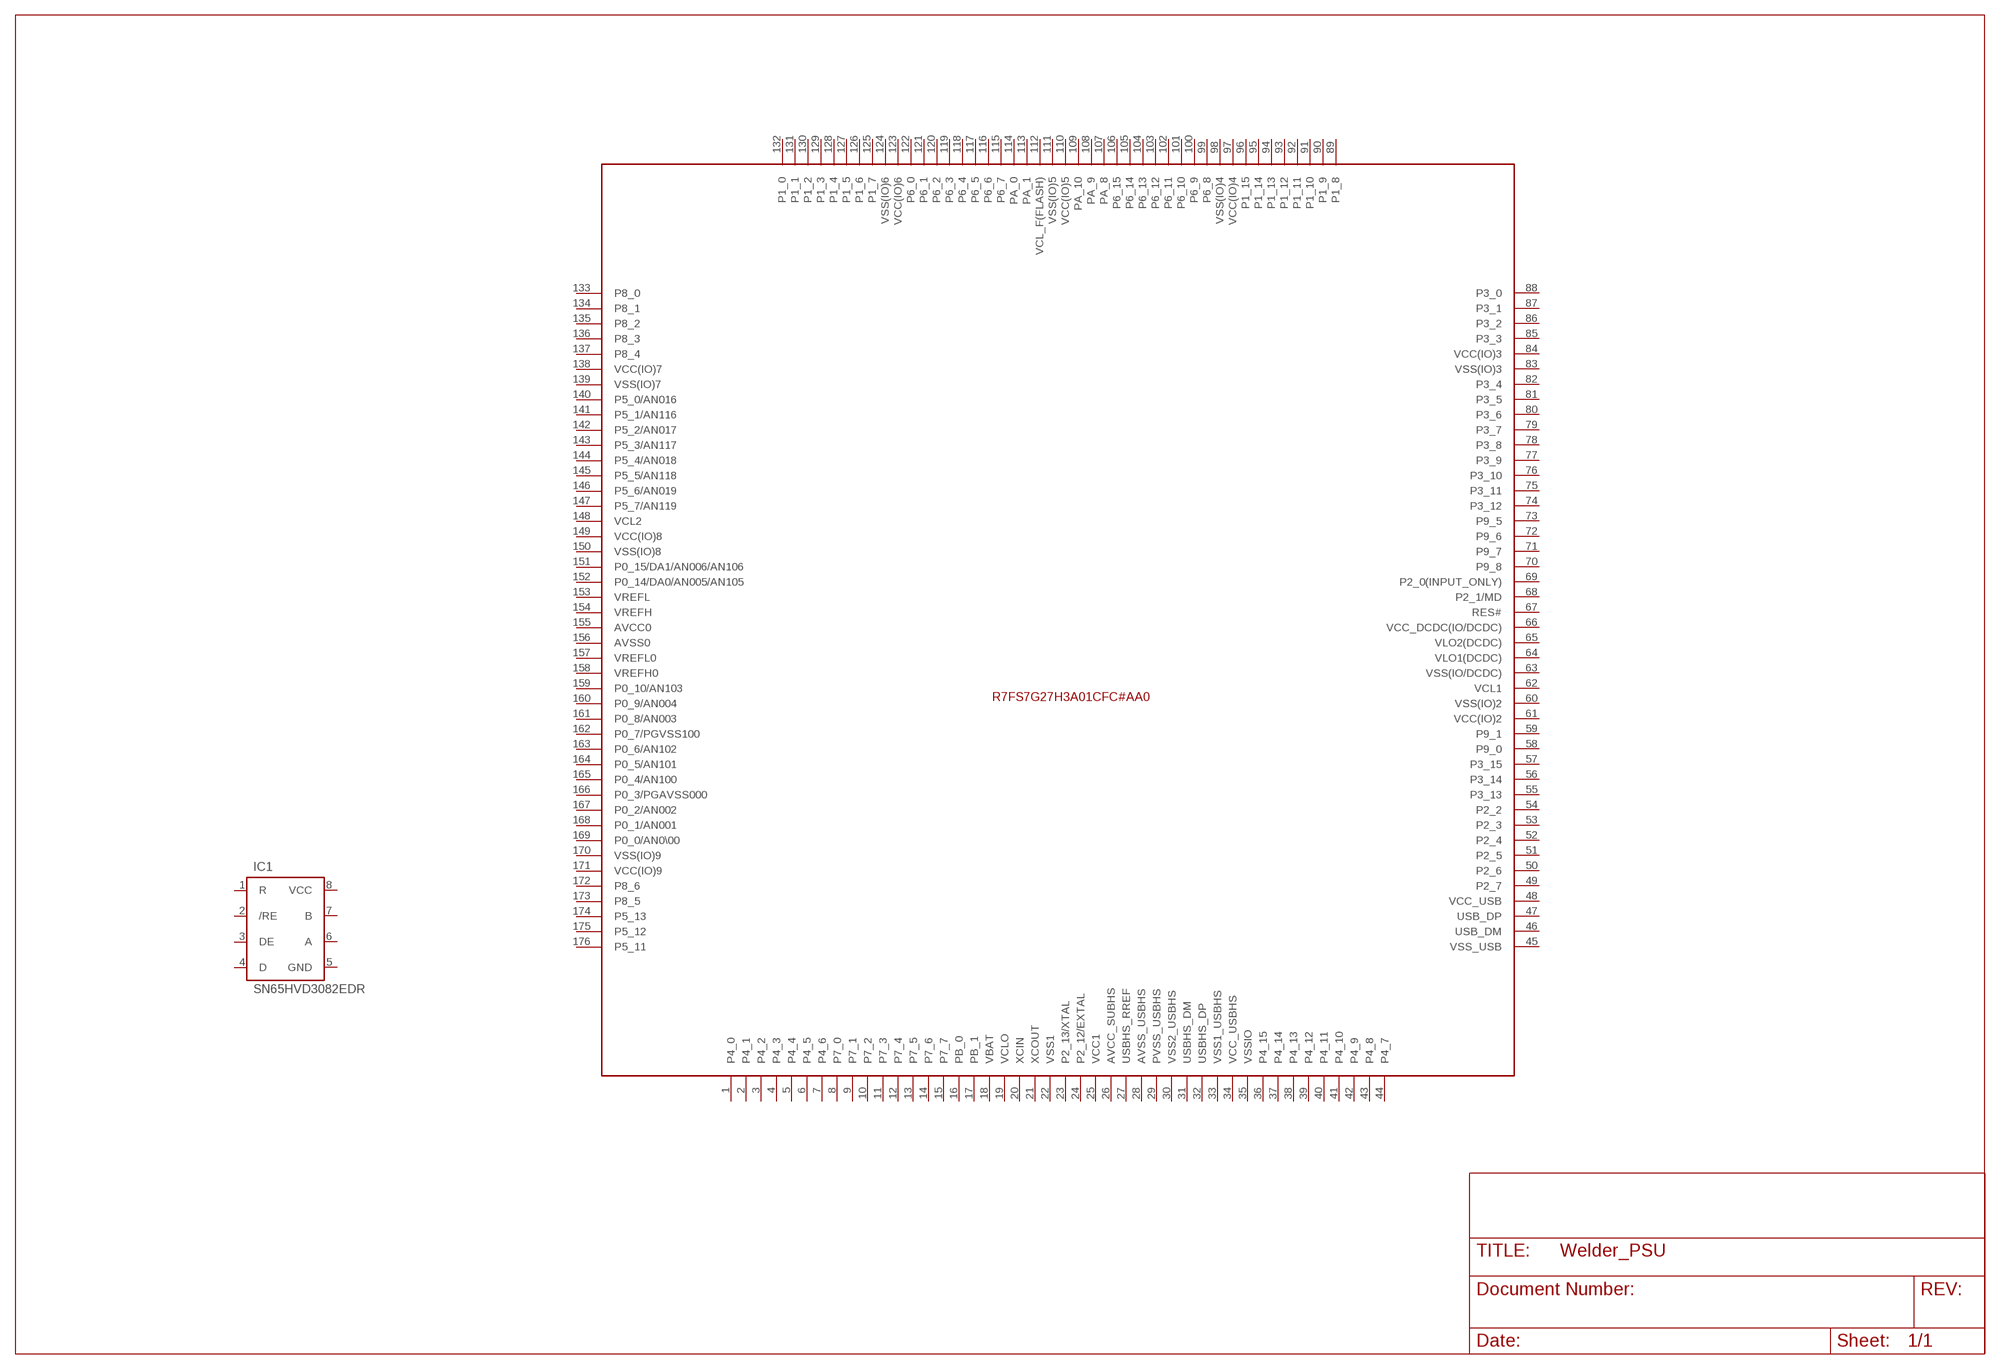
[diagram p5: schematic, module 40_MCU, sheet 1]

### Parts
IC1  SN65HVD3082EDR  [SOIC8]
U1  S7G2LQFP176  S7G2_X_176  [LQFP176_24X24]
Unconnected: IC1.1(R) IC1.2(/RE) IC1.3(DE) IC1.4(D) IC1.5(GND) IC1.6(A) IC1.7(B) IC1.8(VCC) U1.1(P4_0) U1.2(P4_1) U1.3(P4_2) U1.4(P4_3) U1.5(P4_4) U1.6(P4_5) U1.7(P4_6) U1.8(P7_0) U1.9(P7_1) U1.10(P7_2) U1.11(P7_3) U1.12(P7_4) U1.13(P7_5) U1.14(P7_6) U1.15(P7_7) U1.16(PB_0) U1.17(PB_1) U1.18(VBAT) U1.19(VCLO) U1.20(XCIN) U1.21(XCOUT) U1.22(VSS1) U1.23(P2_13/XTAL) U1.24(P2_12/EXTAL) U1.25(VCC1) U1.26(AVCC_SUBHS) U1.27(USBHS_RREF) U1.28(AVSS_USBHS) U1.29(PVSS_USBHS) U1.30(VSS2_USBHS) U1.31(USBHS_DM) U1.32(USBHS_DP) U1.33(VSS1_USBHS) U1.34(VCC_USBHS) U1.35(VSSIO) U1.36(P4_15) U1.37(P4_14) U1.38(P4_13) U1.39(P4_12) U1.40(P4_11) U1.41(P4_10) U1.42(P4_9) U1.43(P4_8) U1.44(P4_7) U1.45(VSS_USB) U1.46(USB_DM) U1.47(USB_DP) U1.48(VCC_USB) U1.49(P2_7) U1.50(P2_6) U1.51(P2_5) U1.52(P2_4) U1.53(P2_3) U1.54(P2_2) U1.55(P3_13) U1.56(P3_14) U1.57(P3_15) U1.58(P9_0) U1.59(P9_1) U1.60(VSS(IO)2) U1.61(VCC(IO)2) U1.62(VCL1) U1.63(VSS(IO/DCDC)) U1.64(VLO1(DCDC)) U1.65(VLO2(DCDC)) U1.66(VCC_DCDC(IO/DCDC)) U1.67(RES#) U1.68(P2_1/MD) U1.69(P2_0(INPUT_ONLY)) U1.70(P9_8) U1.71(P9_7) U1.72(P9_6) U1.73(P9_5) U1.74(P3_12) U1.75(P3_11) U1.76(P3_10) U1.77(P3_9) U1.78(P3_8) U1.79(P3_7) U1.80(P3_6) U1.81(P3_5) U1.82(P3_4) U1.83(VSS(IO)3) U1.84(VCC(IO)3) U1.85(P3_3) U1.86(P3_2) U1.87(P3_1) U1.88(P3_0) U1.89(P1_8) U1.90(P1_9) U1.91(P1_10) U1.92(P1_11) U1.93(P1_12) U1.94(P1_13) U1.95(P1_14) U1.96(P1_15) U1.97(VCC(IO)4) U1.98(VSS(IO)4) U1.99(P6_8) U1.100(P6_9) U1.101(P6_10) U1.102(P6_11) U1.103(P6_12) U1.104(P6_13) U1.105(P6_14) U1.106(P6_15) U1.107(PA_8) U1.108(PA_9) U1.109(PA_10) U1.110(VCC(IO)5) U1.111(VSS(IO)5) U1.112(VCL_F(FLASH)) U1.113(PA_1) U1.114(PA_0) U1.115(P6_7) U1.116(P6_6) U1.117(P6_5) U1.118(P6_4) U1.119(P6_3) U1.120(P6_2) U1.121(P6_1) U1.122(P6_0) U1.123(VCC(IO)6) U1.124(VSS(IO)6) U1.125(P1_7) U1.126(P1_6) U1.127(P1_5) U1.128(P1_4) U1.129(P1_3) U1.130(P1_2) U1.131(P1_1) U1.132(P1_0) U1.133(P8_0) U1.134(P8_1) U1.135(P8_2) U1.136(P8_3) U1.137(P8_4) U1.138(VCC(IO)7) U1.139(VSS(IO)7) U1.140(P5_0/AN016) U1.141(P5_1/AN116) U1.142(P5_2/AN017) U1.143(P5_3/AN117) U1.144(P5_4/AN018) U1.145(P5_5/AN118) U1.146(P5_6/AN019) U1.147(P5_7/AN119) U1.148(VCL2) U1.149(VCC(IO)8) U1.150(VSS(IO)8) U1.151(P0_15/DA1/AN006/AN106) U1.152(P0_14/DA0/AN005/AN105) U1.153(VREFL) U1.154(VREFH) U1.155(AVCC0) U1.156(AVSS0) U1.157(VREFL0) U1.158(VREFH0) U1.159(P0_10/AN103) U1.160(P0_9/AN004) U1.161(P0_8/AN003) U1.162(P0_7/PGVSS100) U1.163(P0_6/AN102) U1.164(P0_5/AN101) U1.165(P0_4/AN100) U1.166(P0_3/PGAVSS000) U1.167(P0_2/AN002) U1.168(P0_1/AN001) U1.169(P0_0/AN0\00) U1.170(VSS(IO)9) U1.171(VCC(IO)9) U1.172(P8_6) U1.173(P8_5) U1.174(P5_13) U1.175(P5_12) U1.176(P5_11)

### Library data of the parts
IC1 = Labops_Lib_AH:SN65HVD3082EDR; DESCRIPTION: RS485 Transciever, 200Kbps, SOIC-8 , ALT: TP8485E-SR (3Peak); LIB_STATUS: Prototype; MFN: SN65HVD3082EDR; MFR: TI,3Peak; OUR_STOCK: 10; PART_VALUE: RS485 Driver; PRICE-1: 0.30; SUPPLIER-1: LCSC
U1 = Labops_Lib_AH:S7G2_X_176; PARTNO: R7FS7G27H3A01CFC#AA0

## Net classes
1 HV-L: clearance 0.254 mm to class 0
2 HV-N: clearance 0.254 mm to class 0, clearance 1.016 mm to class 1
3 LV: clearance 0.203 mm to class 0, clearance 1.016 mm to class 1, clearance 1.016 mm to class 2
4 HV-Plus: clearance 0.254 mm to class 0, clearance 1.016 mm to class 1, clearance 1.016 mm to class 2, clearance 1.016 mm to class 3
5 HV-Minus: clearance 0.254 mm to class 0, clearance 1.016 mm to class 1, clearance 1.016 mm to class 2, clearance 1.016 mm to class 3, clearance 1.016 mm to class 4